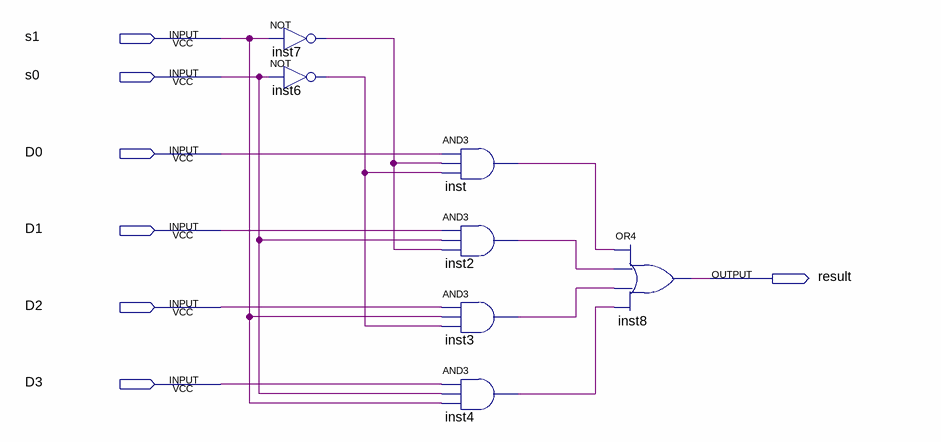
[diagram p0: schematic sheet]
// Quartus schematic Mux_4X1.bdf as structural Verilog: 7 symbols, 7 pins
module Mux_4X1 (
  input  s1,
  input  s0,
  input  D0,
  input  D1,
  input  D2,
  input  D3,
  output result
);

  wire inst2_out, inst3_out, inst4_out, inst6_out, inst7_out, inst_out;

  not inst7 (inst7_out, s1);
  not inst6 (inst6_out, s0);
  and inst (inst_out, D0, inst7_out, inst6_out);
  and inst2 (inst2_out, D1, s0, inst7_out);
  and inst3 (inst3_out, D2, s1, inst6_out);
  and inst4 (inst4_out, D3, s0, s1);
  or inst8 (result, inst_out, inst2_out, inst3_out, inst4_out);
endmodule
